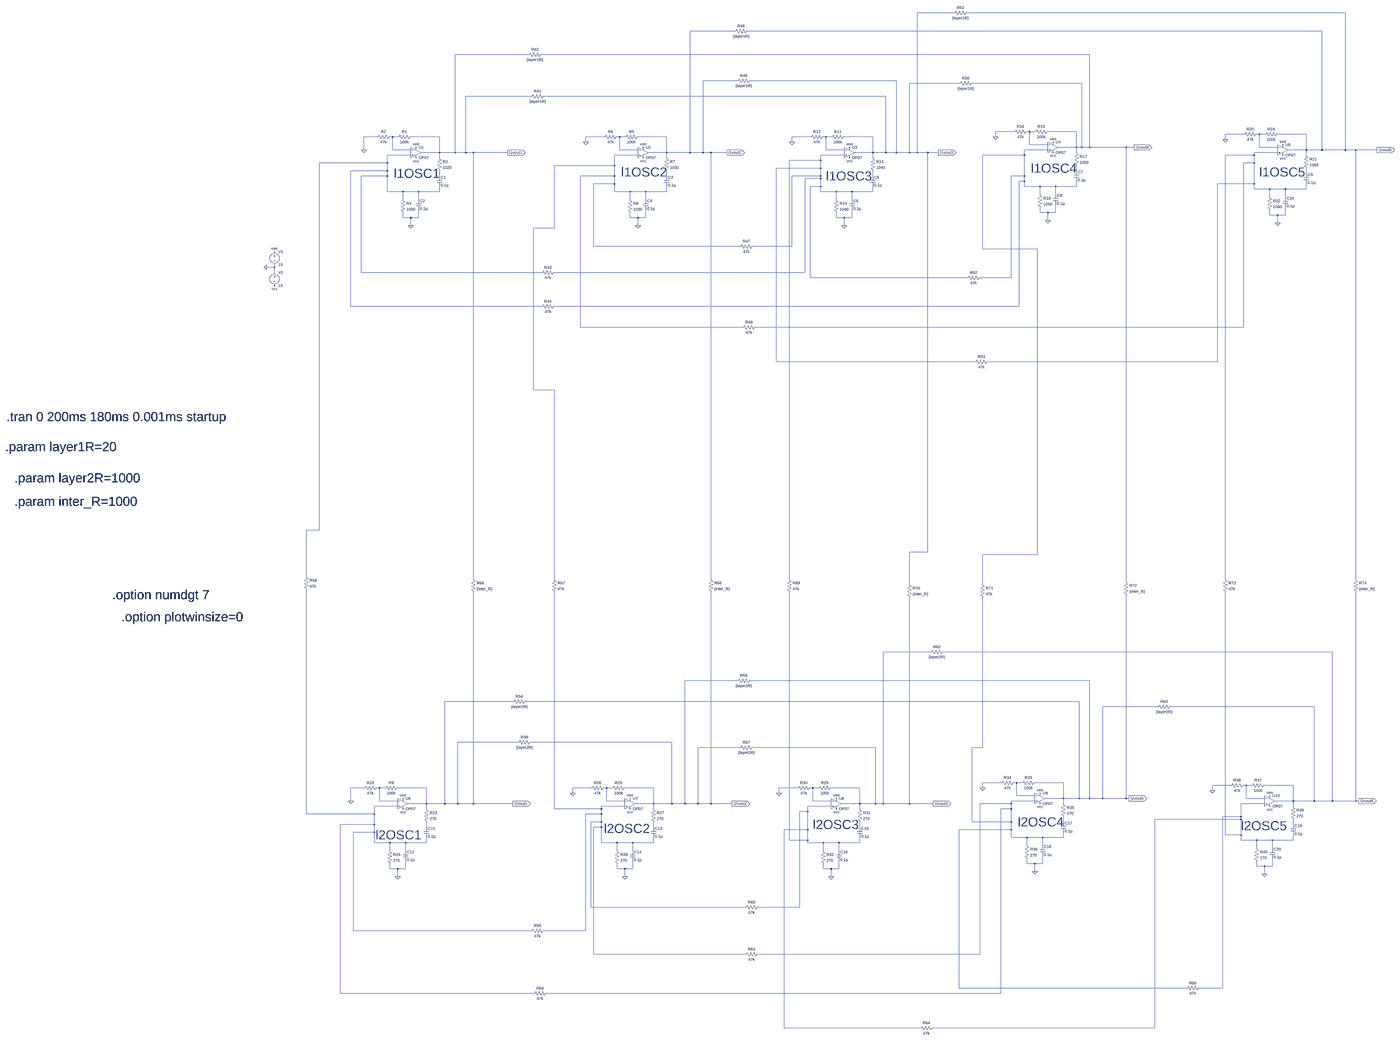
[diagram p0: schematic coupled_wein_bridge_mirror_interlayer.asc, whole sheet]
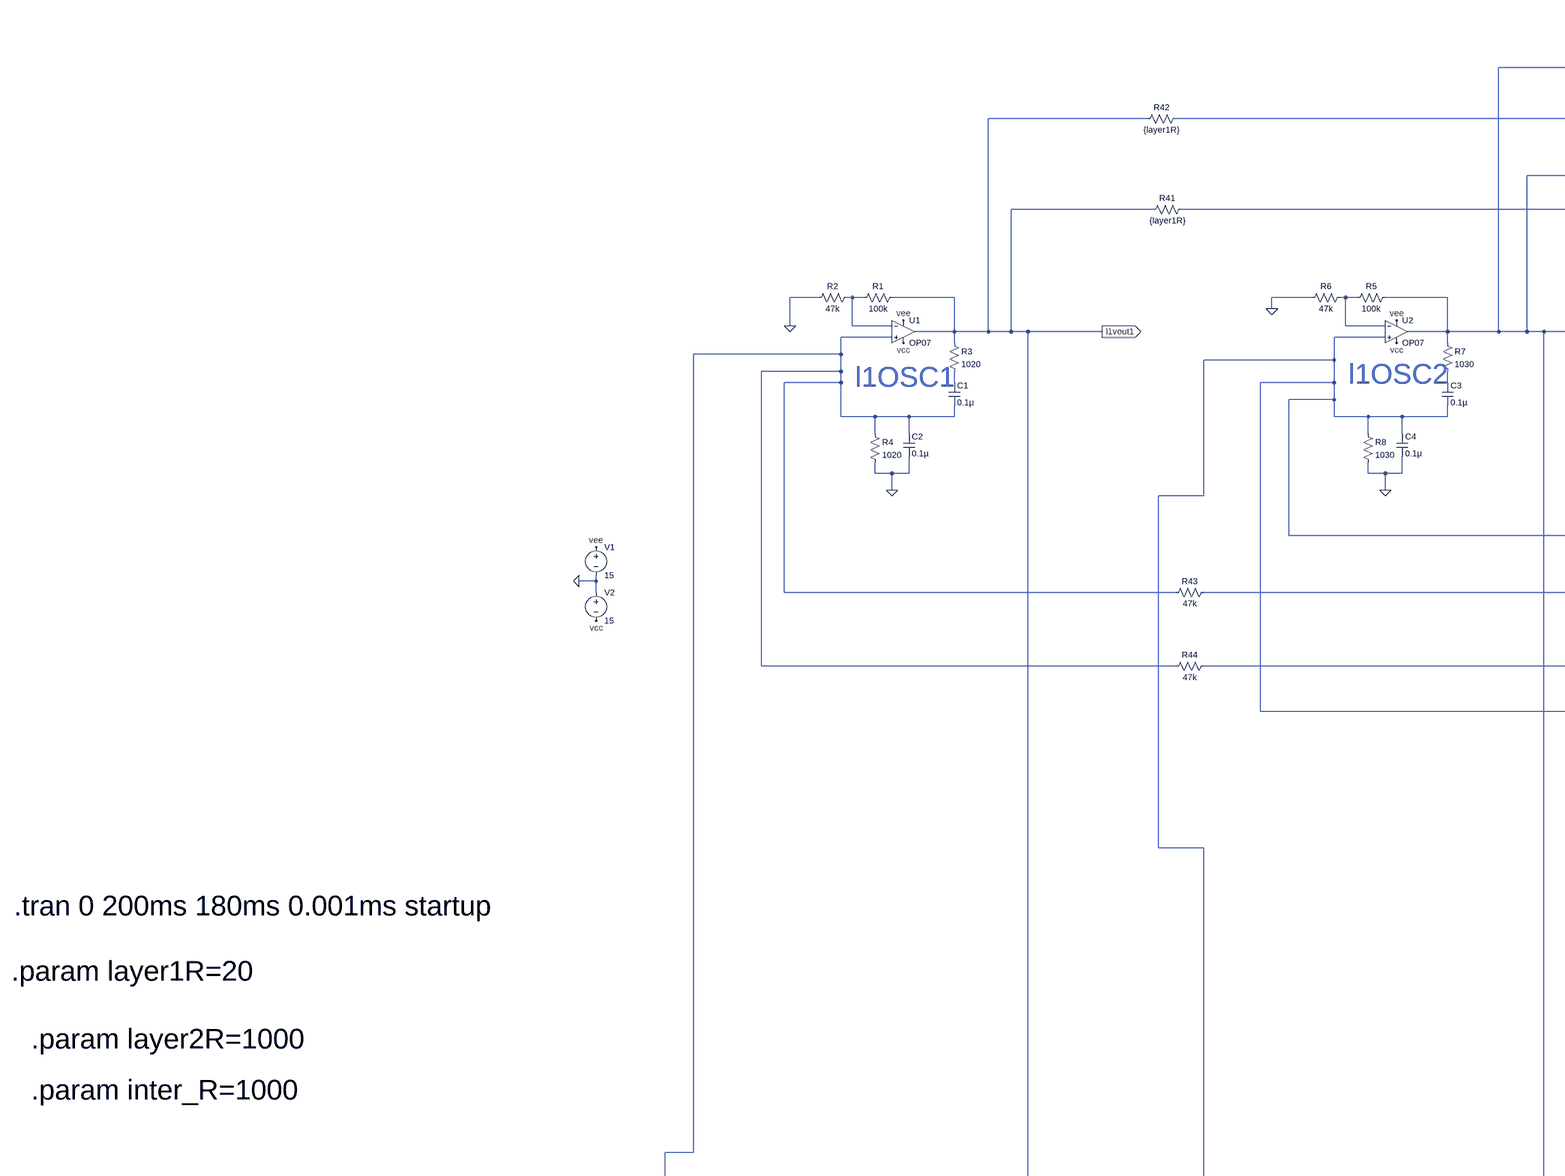
[diagram p1: schematic coupled_wein_bridge_mirror_interlayer.asc, part, row 1 of 2, column 1 of 2]
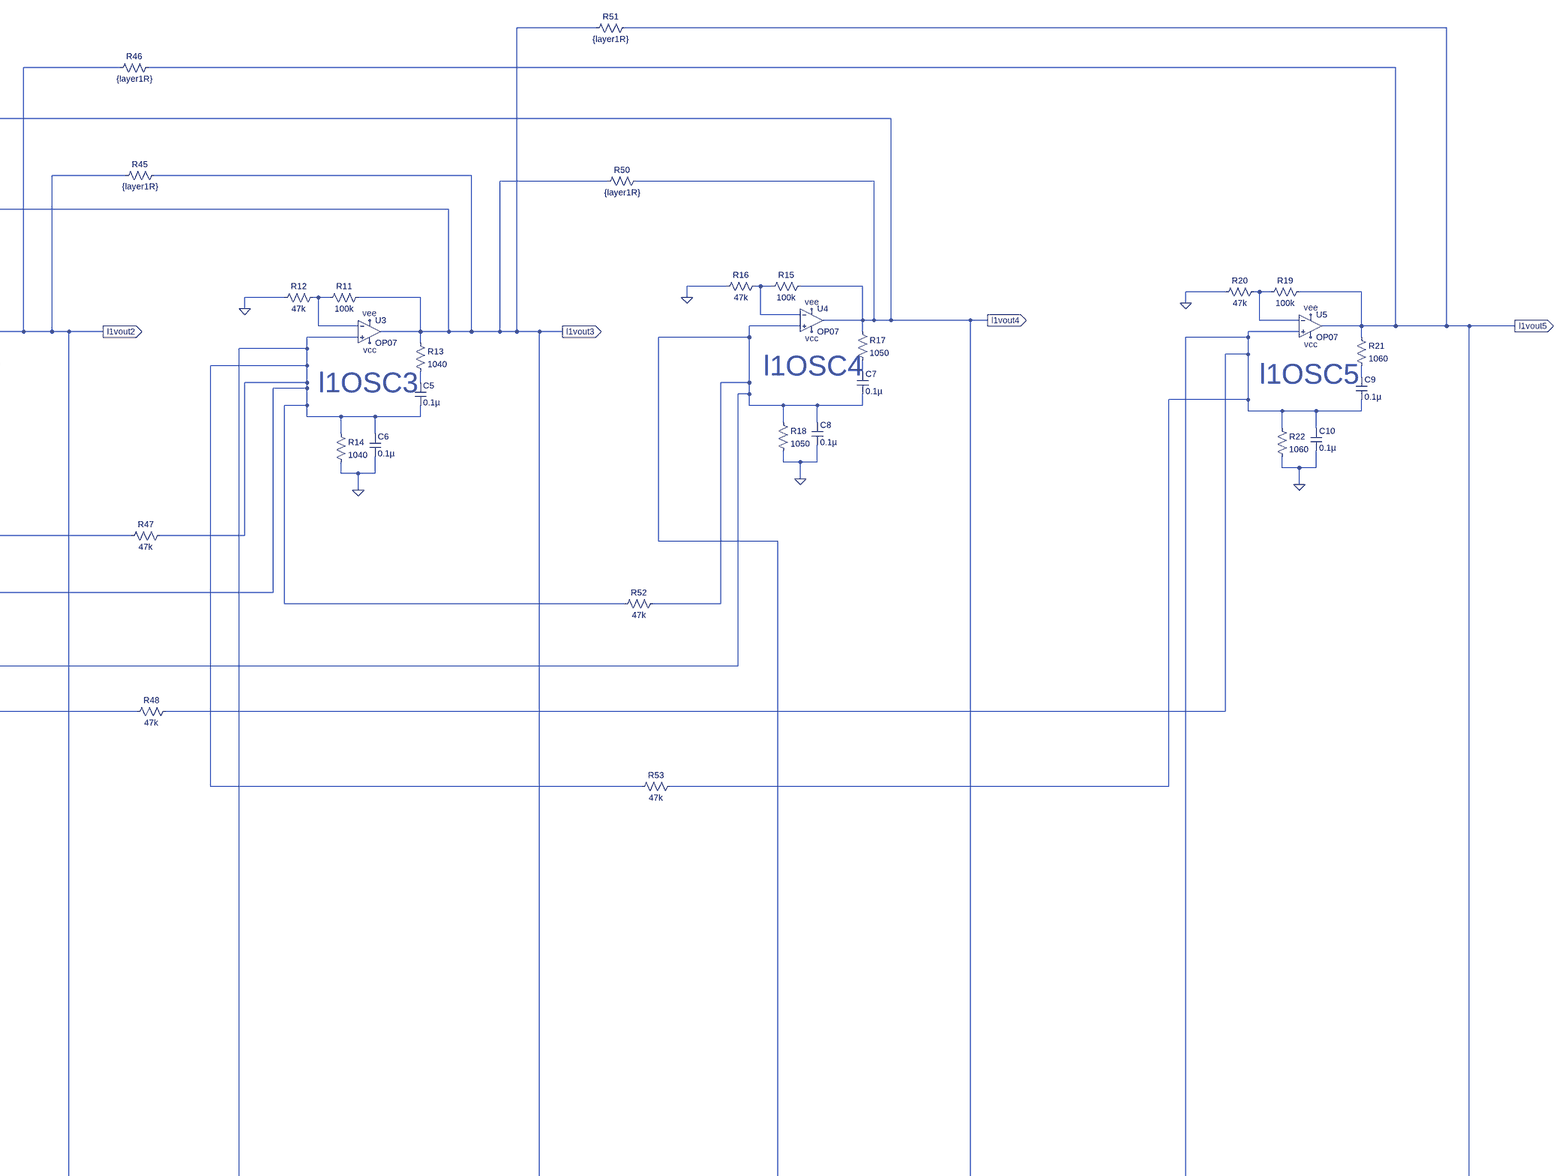
[diagram p2: schematic coupled_wein_bridge_mirror_interlayer.asc, part, row 1 of 2, column 2 of 2]
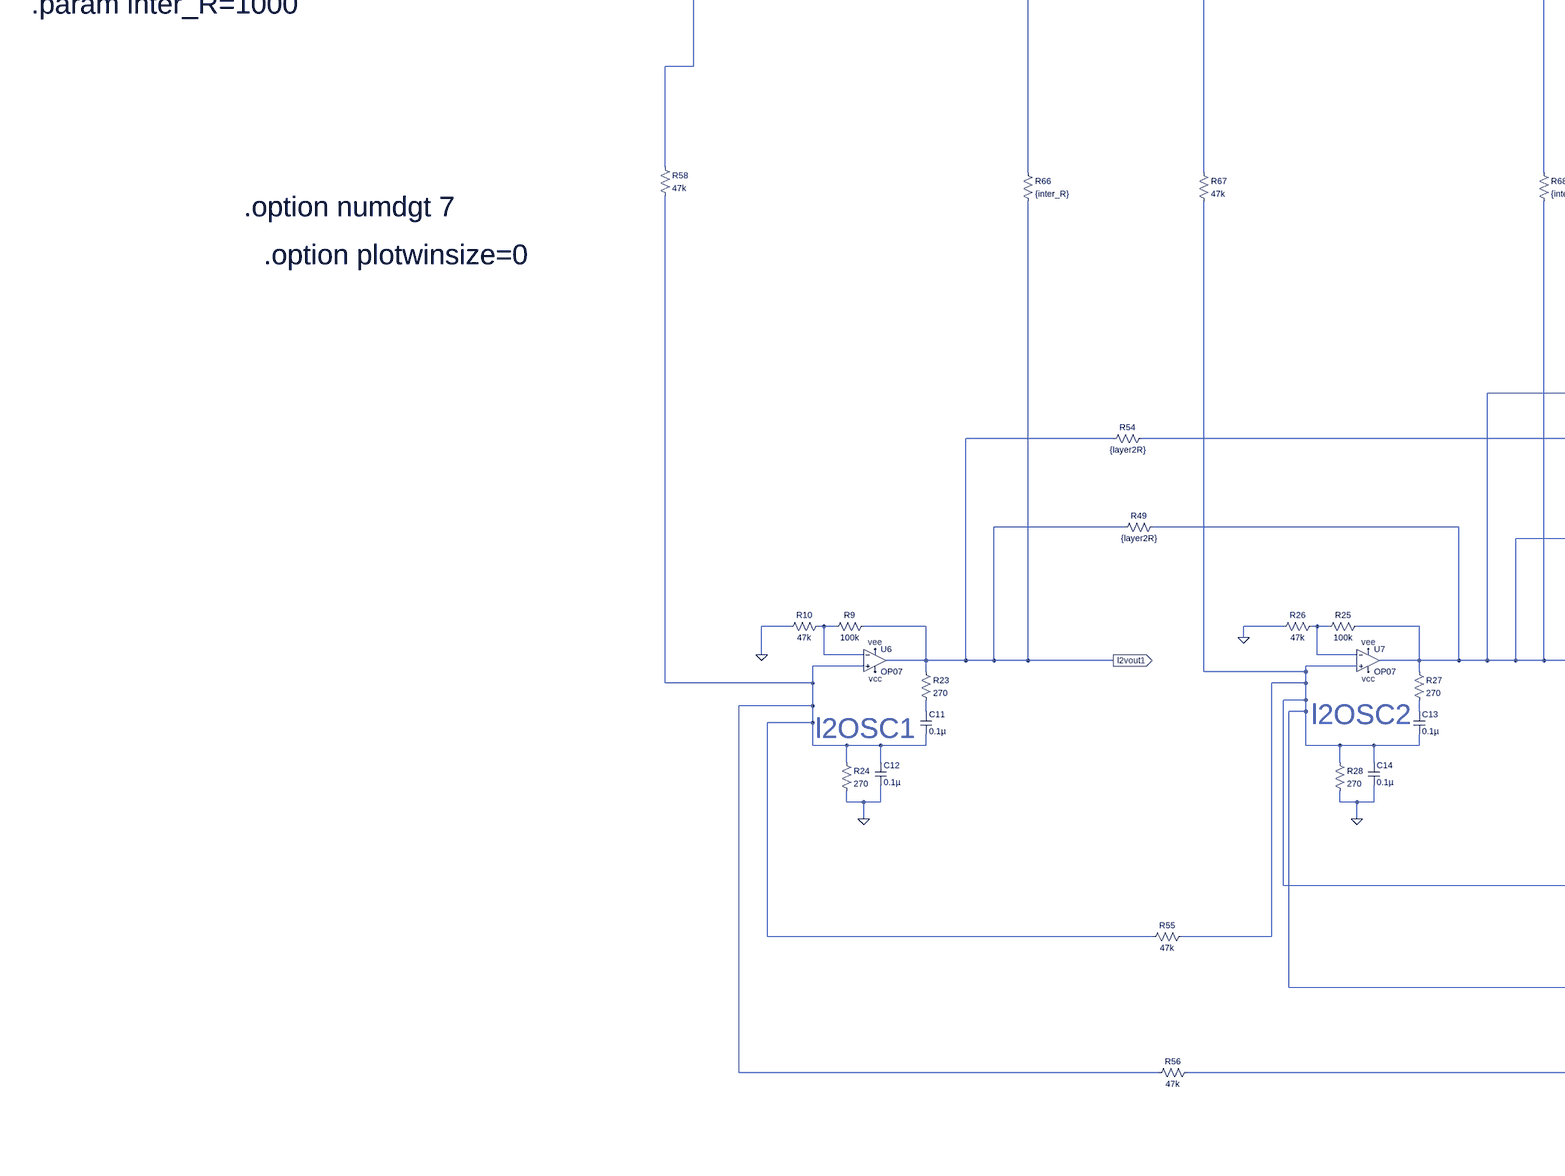
[diagram p3: schematic coupled_wein_bridge_mirror_interlayer.asc, part, row 2 of 2, column 1 of 2]
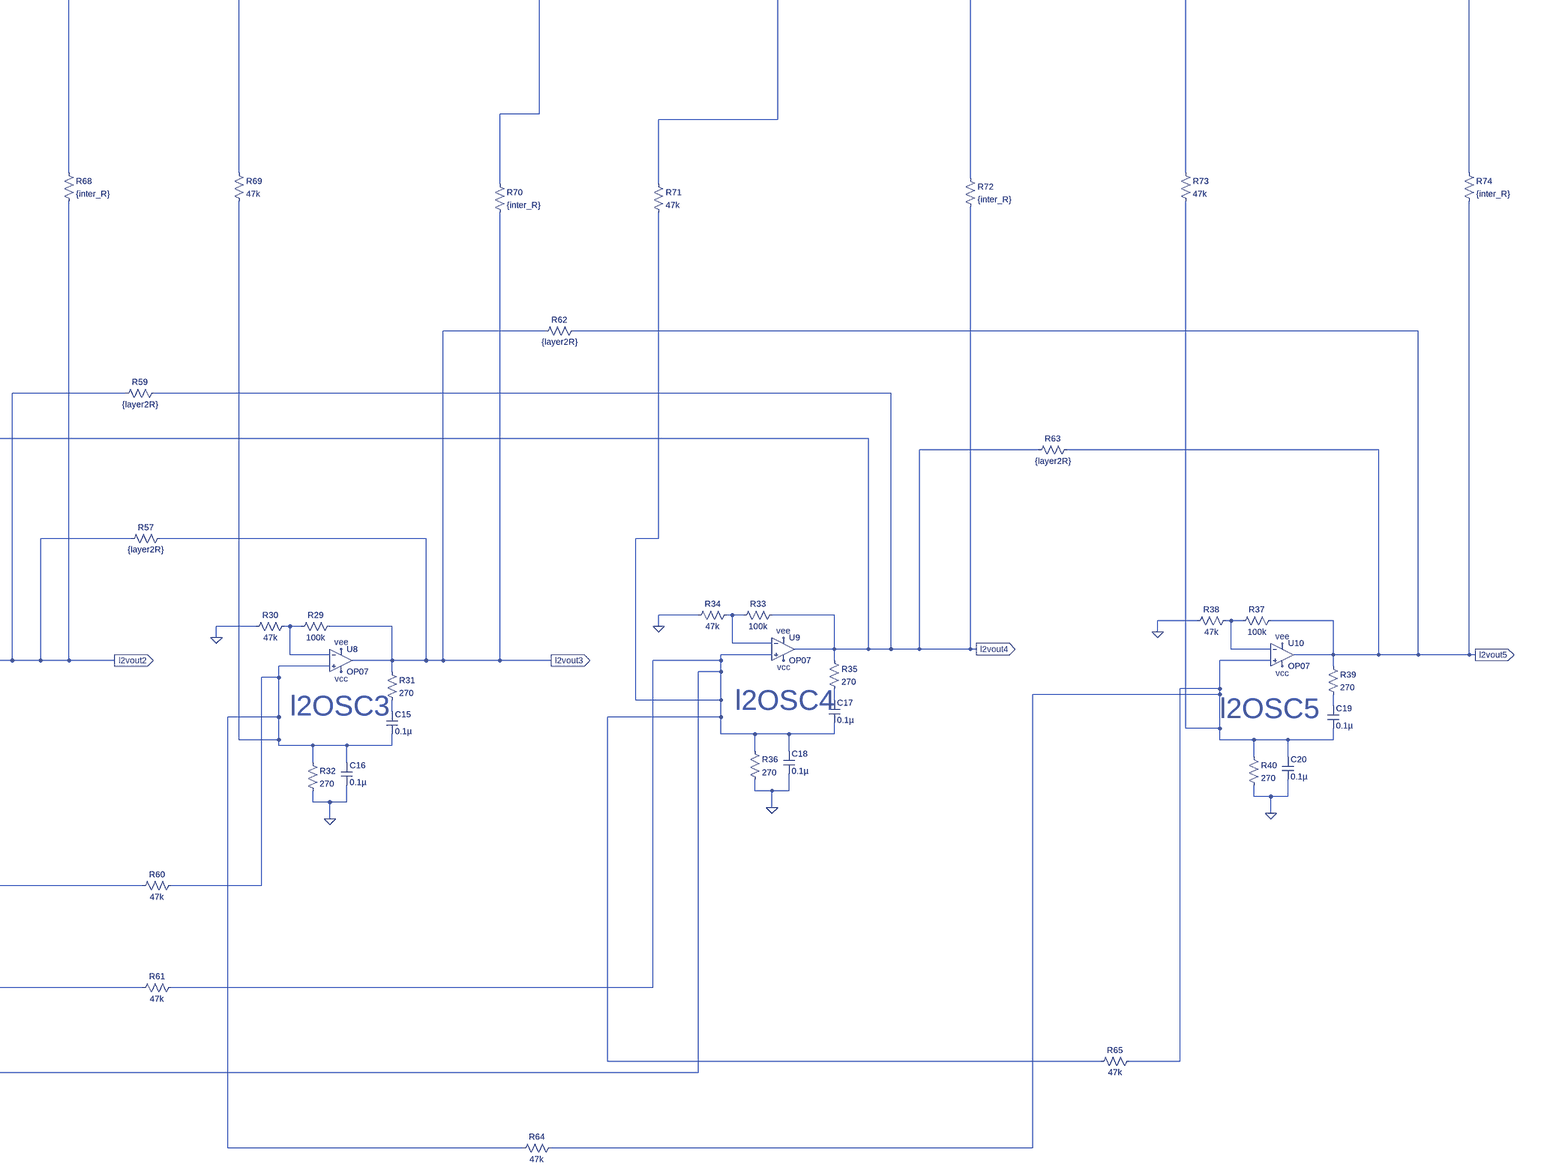
[diagram p4: schematic coupled_wein_bridge_mirror_interlayer.asc, part, row 2 of 2, column 2 of 2]
coupled_wein_bridge_mirror_interlayer.asc, the LTspice schematic file:
Version 4.1
SHEET 1 3756 7424
WIRE 112 -736 -112 -736
WIRE 2512 -736 192 -736
WIRE -1232 -624 -1504 -624
WIRE 2368 -624 -1152 -624
WIRE -2496 -480 -2944 -480
WIRE 944 -480 -2416 -480
WIRE -1216 -320 -1424 -320
WIRE -240 -320 -1136 -320
WIRE 144 -304 -160 -304
WIRE 896 -304 224 -304
WIRE -2480 -224 -2880 -224
WIRE -304 -224 -2400 -224
WIRE 480 128 368 128
WIRE 576 128 560 128
WIRE 608 128 576 128
WIRE 864 128 688 128
WIRE 1888 144 1776 144
WIRE 1984 144 1968 144
WIRE 2016 144 1984 144
WIRE 2272 144 2096 144
WIRE -3424 160 -3504 160
WIRE -3328 160 -3344 160
WIRE -3296 160 -3328 160
WIRE -3040 160 -3216 160
WIRE -2032 160 -2144 160
WIRE -1936 160 -1952 160
WIRE -1904 160 -1936 160
WIRE -1648 160 -1824 160
WIRE -768 160 -880 160
WIRE -672 160 -688 160
WIRE -640 160 -672 160
WIRE -384 160 -560 160
WIRE 368 160 368 128
WIRE 1776 176 1776 144
WIRE -2144 192 -2144 160
WIRE -880 192 -880 160
WIRE 576 208 576 128
WIRE 688 208 576 208
WIRE 864 224 864 128
WIRE 864 224 752 224
WIRE 896 224 896 -304
WIRE 896 224 864 224
WIRE 944 224 944 -480
WIRE 944 224 896 224
WIRE 1168 224 944 224
WIRE 1216 224 1168 224
WIRE 1984 224 1984 144
WIRE 2096 224 1984 224
WIRE -3504 240 -3504 160
WIRE -3328 240 -3328 160
WIRE -3216 240 -3328 240
WIRE -1936 240 -1936 160
WIRE -1824 240 -1936 240
WIRE -672 240 -672 160
WIRE -560 240 -672 240
WIRE 688 240 544 240
WIRE 2272 240 2272 144
WIRE 2272 240 2160 240
WIRE 2368 240 2368 -624
WIRE 2368 240 2272 240
WIRE 2512 240 2512 -736
WIRE 2512 240 2368 240
WIRE 2576 240 2512 240
WIRE 2704 240 2576 240
WIRE -3040 256 -3040 160
WIRE -3040 256 -3152 256
WIRE -2944 256 -2944 -480
WIRE -2944 256 -3040 256
WIRE -2880 256 -2880 -224
WIRE -2880 256 -2944 256
WIRE -2832 256 -2880 256
WIRE -2624 256 -2832 256
WIRE -1648 256 -1648 160
WIRE -1648 256 -1760 256
WIRE -1504 256 -1504 -624
WIRE -1504 256 -1648 256
WIRE -1424 256 -1424 -320
WIRE -1424 256 -1504 256
WIRE -1376 256 -1424 256
WIRE -1280 256 -1376 256
WIRE -384 256 -384 160
WIRE -384 256 -496 256
WIRE -304 256 -304 -224
WIRE -304 256 -384 256
WIRE -240 256 -240 -320
WIRE -240 256 -304 256
WIRE -160 256 -160 -304
WIRE -160 256 -240 256
WIRE -112 256 -112 -736
WIRE -112 256 -160 256
WIRE -48 256 -112 256
WIRE 16 256 -48 256
WIRE 864 256 864 224
WIRE 2096 256 1952 256
WIRE -3216 272 -3360 272
WIRE -1824 272 -1968 272
WIRE -560 272 -704 272
WIRE 544 272 544 240
WIRE 544 272 288 272
WIRE 1952 272 1952 256
WIRE 1952 272 1776 272
WIRE 2272 272 2272 240
WIRE -3040 288 -3040 256
WIRE -1648 288 -1648 256
WIRE -384 288 -384 256
WIRE -704 304 -704 272
WIRE -704 304 -896 304
WIRE -3360 320 -3360 272
WIRE -3360 320 -3776 320
WIRE 1952 320 1952 272
WIRE 1952 320 1888 320
WIRE -1968 336 -1968 272
WIRE -1968 336 -2336 336
WIRE -704 352 -704 304
WIRE -704 352 -976 352
WIRE -3360 368 -3360 320
WIRE -3360 368 -3584 368
WIRE 864 368 864 336
WIRE 2272 384 2272 352
WIRE -3360 400 -3360 368
WIRE -3360 400 -3520 400
WIRE -3040 400 -3040 368
WIRE -1968 400 -1968 336
WIRE -1968 400 -2176 400
WIRE -1648 400 -1648 368
WIRE -704 400 -704 352
WIRE -704 400 -880 400
WIRE -384 400 -384 368
WIRE 544 400 544 272
WIRE 544 400 464 400
WIRE -704 416 -704 400
WIRE -704 416 -800 416
WIRE 544 432 544 400
WIRE 544 432 512 432
WIRE -1968 448 -1968 400
WIRE -1968 448 -2096 448
WIRE 1952 448 1952 320
WIRE 1952 448 1728 448
WIRE -704 464 -704 416
WIRE -704 464 -768 464
WIRE 544 464 544 432
WIRE 640 464 544 464
WIRE 736 464 640 464
WIRE 864 464 864 432
WIRE 864 464 736 464
WIRE 1952 480 1952 448
WIRE 2048 480 1952 480
WIRE 2144 480 2048 480
WIRE 2272 480 2272 448
WIRE 2272 480 2144 480
WIRE -3360 496 -3360 400
WIRE -3264 496 -3360 496
WIRE -3168 496 -3264 496
WIRE -3040 496 -3040 464
WIRE -3040 496 -3168 496
WIRE -1968 496 -1968 448
WIRE -1872 496 -1968 496
WIRE -1776 496 -1872 496
WIRE -1648 496 -1648 464
WIRE -1648 496 -1776 496
WIRE -704 496 -704 464
WIRE -608 496 -704 496
WIRE -512 496 -608 496
WIRE -384 496 -384 464
WIRE -384 496 -512 496
WIRE 640 512 640 464
WIRE 736 512 736 464
WIRE 2048 528 2048 480
WIRE 2144 528 2144 480
WIRE -3264 544 -3264 496
WIRE -3168 544 -3168 496
WIRE -1872 544 -1872 496
WIRE -1776 544 -1776 496
WIRE -608 544 -608 496
WIRE -512 544 -512 496
WIRE 640 624 640 592
WIRE 688 624 640 624
WIRE 736 624 736 576
WIRE 736 624 688 624
WIRE 2048 640 2048 608
WIRE 2096 640 2048 640
WIRE 2144 640 2144 592
WIRE 2144 640 2096 640
WIRE -3264 656 -3264 624
WIRE -3216 656 -3264 656
WIRE -3168 656 -3168 608
WIRE -3168 656 -3216 656
WIRE -1872 656 -1872 624
WIRE -1824 656 -1872 656
WIRE -1776 656 -1776 608
WIRE -1776 656 -1824 656
WIRE -608 656 -608 624
WIRE -560 656 -608 656
WIRE -512 656 -512 608
WIRE -512 656 -560 656
WIRE 688 672 688 624
WIRE 2096 688 2096 640
WIRE -3216 704 -3216 656
WIRE -1824 704 -1824 656
WIRE -560 704 -560 656
WIRE -2336 720 -2336 336
WIRE -2336 720 -2464 720
WIRE -2096 832 -2096 448
WIRE -1200 832 -2096 832
WIRE -880 832 -880 400
WIRE -880 832 -1120 832
WIRE 288 848 288 272
WIRE 624 848 288 848
WIRE -4064 960 -4064 944
WIRE -4064 960 -4112 960
WIRE -4064 992 -4064 960
WIRE -3520 992 -3520 400
WIRE -2416 992 -3520 992
WIRE -800 992 -800 416
WIRE -800 992 -2336 992
WIRE -768 1024 -768 464
WIRE 192 1024 -768 1024
WIRE 464 1024 464 400
WIRE 464 1024 272 1024
WIRE -3584 1200 -3584 368
WIRE -2416 1200 -3584 1200
WIRE 512 1200 512 432
WIRE 512 1200 -2336 1200
WIRE -2176 1328 -2176 400
WIRE -1184 1328 -2176 1328
WIRE 1888 1328 1888 320
WIRE 1888 1328 -1104 1328
WIRE -976 1552 -976 352
WIRE 240 1552 -976 1552
WIRE 1728 1552 1728 448
WIRE 1728 1552 320 1552
WIRE -2464 1728 -2464 720
WIRE -2336 1728 -2464 1728
WIRE -3776 2720 -3776 320
WIRE -3776 2720 -3856 2720
WIRE -48 2880 -48 256
WIRE -48 2880 -160 2880
WIRE 624 2896 624 848
WIRE 624 2896 288 2896
WIRE -3856 3152 -3856 2720
WIRE -2832 3168 -2832 256
WIRE -2336 3168 -2336 1728
WIRE -1376 3168 -1376 256
WIRE -896 3168 -896 304
WIRE 1776 3168 1776 272
WIRE 2576 3168 2576 240
WIRE 1168 3184 1168 224
WIRE -160 3200 -160 2880
WIRE 288 3200 288 2896
WIRE -32 3744 -320 3744
WIRE 2432 3744 48 3744
WIRE -1216 3920 -1536 3920
WIRE 944 3920 -1136 3920
WIRE -2592 4048 -3008 4048
WIRE 880 4048 -2512 4048
WIRE 1360 4080 1024 4080
WIRE 2320 4080 1440 4080
WIRE -2560 4368 -2928 4368
WIRE -1616 4368 -2480 4368
WIRE -1200 4400 -1456 4400
WIRE -368 4400 -1120 4400
WIRE 288 4400 288 3280
WIRE 288 4400 224 4400
WIRE 400 4832 288 4832
WIRE 496 4832 480 4832
WIRE 528 4832 496 4832
WIRE 784 4832 608 4832
WIRE 1808 4848 1696 4848
WIRE 1904 4848 1888 4848
WIRE 1936 4848 1904 4848
WIRE 2192 4848 2016 4848
WIRE -3504 4864 -3584 4864
WIRE -3408 4864 -3424 4864
WIRE -3376 4864 -3408 4864
WIRE -3120 4864 -3296 4864
WIRE -2112 4864 -2224 4864
WIRE -2016 4864 -2032 4864
WIRE -1984 4864 -2016 4864
WIRE -1728 4864 -1904 4864
WIRE -848 4864 -960 4864
WIRE -752 4864 -768 4864
WIRE -720 4864 -752 4864
WIRE -464 4864 -640 4864
WIRE 288 4864 288 4832
WIRE 1696 4880 1696 4848
WIRE -2224 4896 -2224 4864
WIRE -960 4896 -960 4864
WIRE 496 4912 496 4832
WIRE 608 4912 496 4912
WIRE 784 4928 784 4832
WIRE 784 4928 672 4928
WIRE 880 4928 880 4048
WIRE 880 4928 784 4928
WIRE 944 4928 944 3920
WIRE 944 4928 880 4928
WIRE 1024 4928 1024 4080
WIRE 1024 4928 944 4928
WIRE 1168 4928 1168 3264
WIRE 1168 4928 1024 4928
WIRE 1184 4928 1168 4928
WIRE 1904 4928 1904 4848
WIRE 2016 4928 1904 4928
WIRE -3584 4944 -3584 4864
WIRE -3408 4944 -3408 4864
WIRE -3296 4944 -3408 4944
WIRE -2016 4944 -2016 4864
WIRE -1904 4944 -2016 4944
WIRE -752 4944 -752 4864
WIRE -640 4944 -752 4944
WIRE 608 4944 464 4944
WIRE 2192 4944 2192 4848
WIRE 2192 4944 2080 4944
WIRE 2320 4944 2320 4080
WIRE 2320 4944 2192 4944
WIRE 2432 4944 2432 3744
WIRE 2432 4944 2320 4944
WIRE 2576 4944 2576 3248
WIRE 2576 4944 2432 4944
WIRE 2592 4944 2576 4944
WIRE -3120 4960 -3120 4864
WIRE -3120 4960 -3232 4960
WIRE -3008 4960 -3008 4048
WIRE -3008 4960 -3120 4960
WIRE -2928 4960 -2928 4368
WIRE -2928 4960 -3008 4960
WIRE -2832 4960 -2832 3248
WIRE -2832 4960 -2928 4960
WIRE -2592 4960 -2832 4960
WIRE -1728 4960 -1728 4864
WIRE -1728 4960 -1840 4960
WIRE -1616 4960 -1616 4368
WIRE -1616 4960 -1728 4960
WIRE -1536 4960 -1536 3920
WIRE -1536 4960 -1616 4960
WIRE -1456 4960 -1456 4400
WIRE -1456 4960 -1536 4960
WIRE -1376 4960 -1376 3248
WIRE -1376 4960 -1456 4960
WIRE -1248 4960 -1376 4960
WIRE -464 4960 -464 4864
WIRE -464 4960 -576 4960
WIRE -368 4960 -368 4400
WIRE -368 4960 -464 4960
WIRE -320 4960 -320 3744
WIRE -320 4960 -368 4960
WIRE -160 4960 -160 3280
WIRE -160 4960 -320 4960
WIRE -16 4960 -160 4960
WIRE 464 4960 464 4944
WIRE 464 4960 272 4960
WIRE 784 4960 784 4928
WIRE 2016 4960 1872 4960
WIRE -3296 4976 -3440 4976
WIRE -1904 4976 -2048 4976
WIRE -640 4976 -784 4976
WIRE 2192 4976 2192 4944
WIRE -3120 4992 -3120 4960
WIRE -2336 4992 -2336 3248
WIRE -2048 4992 -2048 4976
WIRE -2048 4992 -2336 4992
WIRE -1728 4992 -1728 4960
WIRE -464 4992 -464 4960
WIRE 464 4992 464 4960
WIRE 464 4992 400 4992
WIRE -784 5008 -784 4976
WIRE -784 5008 -832 5008
WIRE -3856 5024 -3856 3232
WIRE -3440 5024 -3440 4976
WIRE -3440 5024 -3856 5024
WIRE -2048 5024 -2048 4992
WIRE -2048 5024 -2144 5024
WIRE 1872 5040 1872 4960
WIRE 1872 5040 1760 5040
WIRE 1872 5056 1872 5040
WIRE 1872 5056 1344 5056
WIRE -2048 5072 -2048 5024
WIRE -2048 5072 -2112 5072
WIRE 224 5072 224 4400
WIRE 464 5072 464 4992
WIRE 464 5072 224 5072
WIRE 784 5072 784 5040
WIRE -3440 5088 -3440 5024
WIRE -3440 5088 -3648 5088
WIRE 2192 5088 2192 5056
WIRE -3120 5104 -3120 5072
WIRE -2048 5104 -2048 5072
WIRE -2048 5104 -2096 5104
WIRE -1728 5104 -1728 5072
WIRE -464 5104 -464 5072
WIRE -784 5120 -784 5008
WIRE -784 5120 -928 5120
WIRE 464 5120 464 5072
WIRE 464 5120 144 5120
WIRE -3440 5136 -3440 5088
WIRE -3440 5136 -3568 5136
WIRE 1776 5152 1776 3248
WIRE 1872 5152 1872 5056
WIRE 1872 5152 1776 5152
WIRE 464 5168 464 5120
WIRE 560 5168 464 5168
WIRE 656 5168 560 5168
WIRE 784 5168 784 5136
WIRE 784 5168 656 5168
WIRE -896 5184 -896 3248
WIRE -784 5184 -784 5120
WIRE -784 5184 -896 5184
WIRE 1872 5184 1872 5152
WIRE 1968 5184 1872 5184
WIRE 2064 5184 1968 5184
WIRE 2192 5184 2192 5152
WIRE 2192 5184 2064 5184
WIRE -3440 5200 -3440 5136
WIRE -3344 5200 -3440 5200
WIRE -3248 5200 -3344 5200
WIRE -3120 5200 -3120 5168
WIRE -3120 5200 -3248 5200
WIRE -2048 5200 -2048 5104
WIRE -1952 5200 -2048 5200
WIRE -1856 5200 -1952 5200
WIRE -1728 5200 -1728 5168
WIRE -1728 5200 -1856 5200
WIRE -784 5200 -784 5184
WIRE -688 5200 -784 5200
WIRE -592 5200 -688 5200
WIRE -464 5200 -464 5168
WIRE -464 5200 -592 5200
WIRE 560 5216 560 5168
WIRE 656 5216 656 5168
WIRE 1968 5232 1968 5184
WIRE 2064 5232 2064 5184
WIRE -3344 5248 -3344 5200
WIRE -3248 5248 -3248 5200
WIRE -1952 5248 -1952 5200
WIRE -1856 5248 -1856 5200
WIRE -688 5248 -688 5200
WIRE -592 5248 -592 5200
WIRE 560 5328 560 5296
WIRE 608 5328 560 5328
WIRE 656 5328 656 5280
WIRE 656 5328 608 5328
WIRE 1968 5344 1968 5312
WIRE 2016 5344 1968 5344
WIRE 2064 5344 2064 5296
WIRE 2064 5344 2016 5344
WIRE -3344 5360 -3344 5328
WIRE -3296 5360 -3344 5360
WIRE -3248 5360 -3248 5312
WIRE -3248 5360 -3296 5360
WIRE -1952 5360 -1952 5328
WIRE -1904 5360 -1952 5360
WIRE -1856 5360 -1856 5312
WIRE -1856 5360 -1904 5360
WIRE -688 5360 -688 5328
WIRE -640 5360 -688 5360
WIRE -592 5360 -592 5312
WIRE -592 5360 -640 5360
WIRE 608 5376 608 5328
WIRE 2016 5392 2016 5344
WIRE -3296 5408 -3296 5360
WIRE -1904 5408 -1904 5360
WIRE -640 5408 -640 5360
WIRE -2112 5600 -2112 5072
WIRE -1168 5600 -2112 5600
WIRE -832 5600 -832 5008
WIRE -832 5600 -1088 5600
WIRE -3568 5744 -3568 5136
WIRE -2480 5744 -3568 5744
WIRE -2144 5744 -2144 5024
WIRE -2144 5744 -2400 5744
WIRE -2096 5888 -2096 5104
WIRE -1168 5888 -2096 5888
WIRE 272 5888 272 4960
WIRE 272 5888 -1088 5888
WIRE 144 6096 144 5120
WIRE 1536 6096 144 6096
WIRE 1760 6096 1760 5040
WIRE 1760 6096 1616 6096
WIRE -3648 6128 -3648 5088
WIRE -2464 6128 -3648 6128
WIRE 400 6128 400 4992
WIRE 400 6128 -2384 6128
WIRE -928 6400 -928 5120
WIRE -96 6400 -928 6400
WIRE 1344 6400 1344 5056
WIRE 1344 6400 -16 6400
FLAG -4112 960 0
FLAG -4064 864 vee
FLAG -4064 1072 vcc
FLAG -3184 224 vee
FLAG -3184 288 vcc
FLAG -3216 704 0
FLAG -2624 256 l1vout1
IOPIN -2624 256 Out
FLAG -1792 224 vee
FLAG -1792 288 vcc
FLAG -1824 704 0
FLAG -1280 256 l1vout2
IOPIN -1280 256 Out
FLAG -3504 240 0
FLAG -2144 192 0
FLAG -528 224 vee
FLAG -528 288 vcc
FLAG -560 704 0
FLAG 16 256 l1vout3
IOPIN 16 256 Out
FLAG -880 192 0
FLAG 720 192 vee
FLAG 720 256 vcc
FLAG 688 672 0
FLAG 1216 224 l1vout4
IOPIN 1216 224 Out
FLAG 368 160 0
FLAG 2128 208 vee
FLAG 2128 272 vcc
FLAG 2096 688 0
FLAG 2704 240 l1vout5
IOPIN 2704 240 Out
FLAG 1776 176 0
FLAG -3264 4928 vee
FLAG -3264 4992 vcc
FLAG -3296 5408 0
FLAG -2592 4960 l2vout1
IOPIN -2592 4960 Out
FLAG -1872 4928 vee
FLAG -1872 4992 vcc
FLAG -1904 5408 0
FLAG -1248 4960 l2vout2
IOPIN -1248 4960 Out
FLAG -3584 4944 0
FLAG -2224 4896 0
FLAG -608 4928 vee
FLAG -608 4992 vcc
FLAG -640 5408 0
FLAG -16 4960 l2vout3
IOPIN -16 4960 Out
FLAG -960 4896 0
FLAG 640 4896 vee
FLAG 640 4960 vcc
FLAG 608 5376 0
FLAG 1184 4928 l2vout4
IOPIN 1184 4928 Out
FLAG 288 4864 0
FLAG 2048 4912 vee
FLAG 2048 4976 vcc
FLAG 2016 5392 0
FLAG 2592 4944 l2vout5
IOPIN 2592 4944 Out
FLAG 1696 4880 0
SYMBOL voltage -4064 848 R0
SYMATTR InstName V1
SYMATTR Value 15
SYMBOL voltage -4064 976 R0
SYMATTR InstName V2
SYMATTR Value 15
SYMBOL OpAmps\\OP07 -3184 192 R0
SYMATTR InstName U1
SYMBOL res -3200 144 R90
WINDOW 0 0 56 VBottom 2
WINDOW 3 32 56 VTop 2
SYMATTR InstName R1
SYMATTR Value 100k
SYMBOL res -3328 144 R90
WINDOW 0 0 56 VBottom 2
WINDOW 3 32 56 VTop 2
SYMATTR InstName R2
SYMATTR Value 47k
SYMBOL res -3056 272 R0
SYMATTR InstName R3
SYMATTR Value 1020
SYMBOL cap -3056 400 R0
SYMATTR InstName C1
SYMATTR Value 0.1µ
SYMBOL res -3280 528 R0
SYMATTR InstName R4
SYMATTR Value 1020
SYMBOL cap -3184 544 R0
SYMATTR InstName C2
SYMATTR Value 0.1µ
SYMBOL OpAmps\\OP07 -1792 192 R0
SYMATTR InstName U2
SYMBOL res -1808 144 R90
WINDOW 0 0 56 VBottom 2
WINDOW 3 32 56 VTop 2
SYMATTR InstName R5
SYMATTR Value 100k
SYMBOL res -1936 144 R90
WINDOW 0 0 56 VBottom 2
WINDOW 3 32 56 VTop 2
SYMATTR InstName R6
SYMATTR Value 47k
SYMBOL res -1664 272 R0
SYMATTR InstName R7
SYMATTR Value 1030
SYMBOL cap -1664 400 R0
SYMATTR InstName C3
SYMATTR Value 0.1µ
SYMBOL res -1888 528 R0
SYMATTR InstName R8
SYMATTR Value 1030
SYMBOL cap -1792 544 R0
SYMATTR InstName C4
SYMATTR Value 0.1µ
SYMBOL OpAmps\\OP07 -528 192 R0
SYMATTR InstName U3
SYMBOL res -544 144 R90
WINDOW 0 0 56 VBottom 2
WINDOW 3 32 56 VTop 2
SYMATTR InstName R11
SYMATTR Value 100k
SYMBOL res -672 144 R90
WINDOW 0 0 56 VBottom 2
WINDOW 3 32 56 VTop 2
SYMATTR InstName R12
SYMATTR Value 47k
SYMBOL res -400 272 R0
SYMATTR InstName R13
SYMATTR Value 1040
SYMBOL cap -400 400 R0
SYMATTR InstName C5
SYMATTR Value 0.1µ
SYMBOL res -624 528 R0
SYMATTR InstName R14
SYMATTR Value 1040
SYMBOL cap -528 544 R0
SYMATTR InstName C6
SYMATTR Value 0.1µ
SYMBOL OpAmps\\OP07 720 160 R0
SYMATTR InstName U4
SYMBOL res 704 112 R90
WINDOW 0 0 56 VBottom 2
WINDOW 3 32 56 VTop 2
SYMATTR InstName R15
SYMATTR Value 100k
SYMBOL res 576 112 R90
WINDOW 0 0 56 VBottom 2
WINDOW 3 32 56 VTop 2
SYMATTR InstName R16
SYMATTR Value 47k
SYMBOL res 848 240 R0
SYMATTR InstName R17
SYMATTR Value 1050
SYMBOL cap 848 368 R0
SYMATTR InstName C7
SYMATTR Value 0.1µ
SYMBOL res 624 496 R0
SYMATTR InstName R18
SYMATTR Value 1050
SYMBOL cap 720 512 R0
SYMATTR InstName C8
SYMATTR Value 0.1µ
SYMBOL OpAmps\\OP07 2128 176 R0
SYMATTR InstName U5
SYMBOL res 2112 128 R90
WINDOW 0 0 56 VBottom 2
WINDOW 3 32 56 VTop 2
SYMATTR InstName R19
SYMATTR Value 100k
SYMBOL res 1984 128 R90
WINDOW 0 0 56 VBottom 2
WINDOW 3 32 56 VTop 2
SYMATTR InstName R20
SYMATTR Value 47k
SYMBOL res 2256 256 R0
SYMATTR InstName R21
SYMATTR Value 1060
SYMBOL cap 2256 384 R0
SYMATTR InstName C9
SYMATTR Value 0.1µ
SYMBOL res 2032 512 R0
SYMATTR InstName R22
SYMATTR Value 1060
SYMBOL cap 2128 528 R0
SYMATTR InstName C10
SYMATTR Value 0.1µ
SYMBOL OpAmps\\OP07 -3264 4896 R0
SYMATTR InstName U6
SYMBOL res -3280 4848 R90
WINDOW 0 0 56 VBottom 2
WINDOW 3 32 56 VTop 2
SYMATTR InstName R9
SYMATTR Value 100k
SYMBOL res -3408 4848 R90
WINDOW 0 0 56 VBottom 2
WINDOW 3 32 56 VTop 2
SYMATTR InstName R10
SYMATTR Value 47k
SYMBOL res -3136 4976 R0
SYMATTR InstName R23
SYMATTR Value 270
SYMBOL cap -3136 5104 R0
SYMATTR InstName C11
SYMATTR Value 0.1µ
SYMBOL res -3360 5232 R0
SYMATTR InstName R24
SYMATTR Value 270
SYMBOL cap -3264 5248 R0
SYMATTR InstName C12
SYMATTR Value 0.1µ
SYMBOL OpAmps\\OP07 -1872 4896 R0
SYMATTR InstName U7
SYMBOL res -1888 4848 R90
WINDOW 0 0 56 VBottom 2
WINDOW 3 32 56 VTop 2
SYMATTR InstName R25
SYMATTR Value 100k
SYMBOL res -2016 4848 R90
WINDOW 0 0 56 VBottom 2
WINDOW 3 32 56 VTop 2
SYMATTR InstName R26
SYMATTR Value 47k
SYMBOL res -1744 4976 R0
SYMATTR InstName R27
SYMATTR Value 270
SYMBOL cap -1744 5104 R0
SYMATTR InstName C13
SYMATTR Value 0.1µ
SYMBOL res -1968 5232 R0
SYMATTR InstName R28
SYMATTR Value 270
SYMBOL cap -1872 5248 R0
SYMATTR InstName C14
SYMATTR Value 0.1µ
SYMBOL OpAmps\\OP07 -608 4896 R0
SYMATTR InstName U8
SYMBOL res -624 4848 R90
WINDOW 0 0 56 VBottom 2
WINDOW 3 32 56 VTop 2
SYMATTR InstName R29
SYMATTR Value 100k
SYMBOL res -752 4848 R90
WINDOW 0 0 56 VBottom 2
WINDOW 3 32 56 VTop 2
SYMATTR InstName R30
SYMATTR Value 47k
SYMBOL res -480 4976 R0
SYMATTR InstName R31
SYMATTR Value 270
SYMBOL cap -480 5104 R0
SYMATTR InstName C15
SYMATTR Value 0.1µ
SYMBOL res -704 5232 R0
SYMATTR InstName R32
SYMATTR Value 270
SYMBOL cap -608 5248 R0
SYMATTR InstName C16
SYMATTR Value 0.1µ
SYMBOL OpAmps\\OP07 640 4864 R0
SYMATTR InstName U9
SYMBOL res 624 4816 R90
WINDOW 0 0 56 VBottom 2
WINDOW 3 32 56 VTop 2
SYMATTR InstName R33
SYMATTR Value 100k
SYMBOL res 496 4816 R90
WINDOW 0 0 56 VBottom 2
WINDOW 3 32 56 VTop 2
SYMATTR InstName R34
SYMATTR Value 47k
SYMBOL res 768 4944 R0
SYMATTR InstName R35
SYMATTR Value 270
SYMBOL cap 768 5072 R0
SYMATTR InstName C17
SYMATTR Value 0.1µ
SYMBOL res 544 5200 R0
SYMATTR InstName R36
SYMATTR Value 270
SYMBOL cap 640 5216 R0
SYMATTR InstName C18
SYMATTR Value 0.1µ
SYMBOL OpAmps\\OP07 2048 4880 R0
SYMATTR InstName U10
SYMBOL res 2032 4832 R90
WINDOW 0 0 56 VBottom 2
WINDOW 3 32 56 VTop 2
SYMATTR InstName R37
SYMATTR Value 100k
SYMBOL res 1904 4832 R90
WINDOW 0 0 56 VBottom 2
WINDOW 3 32 56 VTop 2
SYMATTR InstName R38
SYMATTR Value 47k
SYMBOL res 2176 4960 R0
SYMATTR InstName R39
SYMATTR Value 270
SYMBOL cap 2176 5088 R0
SYMATTR InstName C19
SYMATTR Value 0.1µ
SYMBOL res 1952 5216 R0
SYMATTR InstName R40
SYMATTR Value 270
SYMBOL cap 2048 5232 R0
SYMATTR InstName C20
SYMATTR Value 0.1µ
SYMBOL res -2384 -240 R90
WINDOW 0 0 56 VBottom 2
WINDOW 3 32 56 VTop 2
SYMATTR InstName R41
SYMATTR Value {layer1R}
SYMBOL res -2400 -496 R90
WINDOW 0 0 56 VBottom 2
WINDOW 3 32 56 VTop 2
SYMATTR InstName R42
SYMATTR Value {layer1R}
SYMBOL res -2320 976 R90
WINDOW 0 0 56 VBottom 2
WINDOW 3 32 56 VTop 2
SYMATTR InstName R43
SYMATTR Value 47k
SYMBOL res -2320 1184 R90
WINDOW 0 0 56 VBottom 2
WINDOW 3 32 56 VTop 2
SYMATTR InstName R44
SYMATTR Value 47k
SYMBOL res -1120 -336 R90
WINDOW 0 0 56 VBottom 2
WINDOW 3 32 56 VTop 2
SYMATTR InstName R45
SYMATTR Value {layer1R}
SYMBOL res -1136 -640 R90
WINDOW 0 0 56 VBottom 2
WINDOW 3 32 56 VTop 2
SYMATTR InstName R46
SYMATTR Value {layer1R}
SYMBOL res -1104 816 R90
WINDOW 0 0 56 VBottom 2
WINDOW 3 32 56 VTop 2
SYMATTR InstName R47
SYMATTR Value 47k
SYMBOL res -1088 1312 R90
WINDOW 0 0 56 VBottom 2
WINDOW 3 32 56 VTop 2
SYMATTR InstName R48
SYMATTR Value 47k
SYMBOL res 240 -320 R90
WINDOW 0 0 56 VBottom 2
WINDOW 3 32 56 VTop 2
SYMATTR InstName R50
SYMATTR Value {layer1R}
SYMBOL res 208 -752 R90
WINDOW 0 0 56 VBottom 2
WINDOW 3 32 56 VTop 2
SYMATTR InstName R51
SYMATTR Value {layer1R}
SYMBOL res 288 1008 R90
WINDOW 0 0 56 VBottom 2
WINDOW 3 32 56 VTop 2
SYMATTR InstName R52
SYMATTR Value 47k
SYMBOL res 336 1536 R90
WINDOW 0 0 56 VBottom 2
WINDOW 3 32 56 VTop 2
SYMATTR InstName R53
SYMATTR Value 47k
SYMBOL res -2464 4352 R90
WINDOW 0 0 56 VBottom 2
WINDOW 3 32 56 VTop 2
SYMATTR InstName R49
SYMATTR Value {layer2R}
SYMBOL res -2496 4032 R90
WINDOW 0 0 56 VBottom 2
WINDOW 3 32 56 VTop 2
SYMATTR InstName R54
SYMATTR Value {layer2R}
SYMBOL res -2384 5728 R90
WINDOW 0 0 56 VBottom 2
WINDOW 3 32 56 VTop 2
SYMATTR InstName R55
SYMATTR Value 47k
SYMBOL res -2368 6112 R90
WINDOW 0 0 56 VBottom 2
WINDOW 3 32 56 VTop 2
SYMATTR InstName R56
SYMATTR Value 47k
SYMBOL res -1104 4384 R90
WINDOW 0 0 56 VBottom 2
WINDOW 3 32 56 VTop 2
SYMATTR InstName R57
SYMATTR Value {layer2R}
SYMBOL res -1120 3904 R90
WINDOW 0 0 56 VBottom 2
WINDOW 3 32 56 VTop 2
SYMATTR InstName R59
SYMATTR Value {layer2R}
SYMBOL res -1072 5584 R90
WINDOW 0 0 56 VBottom 2
WINDOW 3 32 56 VTop 2
SYMATTR InstName R60
SYMATTR Value 47k
SYMBOL res -1072 5872 R90
WINDOW 0 0 56 VBottom 2
WINDOW 3 32 56 VTop 2
SYMATTR InstName R61
SYMATTR Value 47k
SYMBOL res 64 3728 R90
WINDOW 0 0 56 VBottom 2
WINDOW 3 32 56 VTop 2
SYMATTR InstName R62
SYMATTR Value {layer2R}
SYMBOL res 1456 4064 R90
WINDOW 0 0 56 VBottom 2
WINDOW 3 32 56 VTop 2
SYMATTR InstName R63
SYMATTR Value {layer2R}
SYMBOL res 0 6384 R90
WINDOW 0 0 56 VBottom 2
WINDOW 3 32 56 VTop 2
SYMATTR InstName R64
SYMATTR Value 47k
SYMBOL res 1632 6080 R90
WINDOW 0 0 56 VBottom 2
WINDOW 3 32 56 VTop 2
SYMATTR InstName R65
SYMATTR Value 47k
SYMBOL res -3872 3136 R0
SYMATTR InstName R58
SYMATTR Value 47k
SYMBOL res -2848 3152 R0
SYMATTR InstName R66
SYMATTR Value {inter_R}
SYMBOL res -2352 3152 R0
SYMATTR InstName R67
SYMATTR Value 47k
SYMBOL res -1392 3152 R0
SYMATTR InstName R68
SYMATTR Value {inter_R}
SYMBOL res -912 3152 R0
SYMATTR InstName R69
SYMATTR Value 47k
SYMBOL res -176 3184 R0
SYMATTR InstName R70
SYMATTR Value {inter_R}
SYMBOL res 272 3184 R0
SYMATTR InstName R71
SYMATTR Value 47k
SYMBOL res 1152 3168 R0
SYMATTR InstName R72
SYMATTR Value {inter_R}
SYMBOL res 1760 3152 R0
SYMATTR InstName R73
SYMATTR Value 47k
SYMBOL res 2560 3152 R0
SYMATTR InstName R74
SYMATTR Value {inter_R}
TEXT -6936 2024 Left 6 !.tran 0 200ms 180ms 0.001ms startup
TEXT -6944 2208 Left 6 !.param layer1R=20
TEXT -1928 376 Left 6 ;l1OSC2
TEXT -672 400 Left 6 ;l1OSC3
TEXT 584 352 Left 6 ;l1OSC4
TEXT 1984 376 Left 6 ;l1OSC5
TEXT -3320 384 Left 6 ;l1OSC1
TEXT -6288 3264 Left 6 !.option numdgt 7
TEXT -6232 3400 Left 6 !.option plotwinsize=0
TEXT -2032 5112 Left 6 ;l2OSC2
TEXT -752 5088 Left 6 ;l2OSC3
TEXT 504 5072 Left 6 ;l2OSC4
TEXT 1872 5096 Left 6 ;l2OSC5
TEXT -3432 5152 Left 6 ;l2OSC1
TEXT -6888 2400 Left 6 !.param layer2R=1000
TEXT -6888 2544 Left 6 !.param inter_R=1000

The netlist it stands for:
* coupled_wein_bridge_mirror_interlayer.asc
V1 vee 0 15
V2 0 vcc 15
X§U1 N008 N003 vee vcc l1vout1 LT1001  ; OP07, pins In+ In- V+ V- OUT
R1 l1vout1 N003 100k
R2 N003 0 47k
R3 l1vout1 N013 1020
C1 N013 N008 0.1µ
R4 N008 0 1020
C2 N008 0 0.1µ
X§U2 N009 N004 vee vcc l1vout2 LT1001  ; OP07, pins In+ In- V+ V- OUT
R5 l1vout2 N004 100k
R6 N004 0 47k
R7 l1vout2 N014 1030
C3 N014 N009 0.1µ
R8 N009 0 1030
C4 N009 0 0.1µ
X§U3 N010 N005 vee vcc l1vout3 LT1001  ; OP07, pins In+ In- V+ V- OUT
R11 l1vout3 N005 100k
R12 N005 0 47k
R13 l1vout3 N015 1040
C5 N015 N010 0.1µ
R14 N010 0 1040
C6 N010 0 0.1µ
X§U4 N006 N001 vee vcc l1vout4 LT1001  ; OP07, pins In+ In- V+ V- OUT
R15 l1vout4 N001 100k
R16 N001 0 47k
R17 l1vout4 N011 1050
C7 N011 N006 0.1µ
R18 N006 0 1050
C8 N006 0 0.1µ
X§U5 N007 N002 vee vcc l1vout5 LT1001  ; OP07, pins In+ In- V+ V- OUT
R19 l1vout5 N002 100k
R20 N002 0 47k
R21 l1vout5 N012 1060
C9 N012 N007 0.1µ
R22 N007 0 1060
C10 N007 0 0.1µ
X§U6 N023 N019 vee vcc l2vout1 LT1001  ; OP07, pins In+ In- V+ V- OUT
R9 l2vout1 N019 100k
R10 N019 0 47k
R23 l2vout1 N028 270
C11 N028 N023 0.1µ
R24 N023 0 270
C12 N023 0 0.1µ
X§U7 N024 N020 vee vcc l2vout2 LT1001  ; OP07, pins In+ In- V+ V- OUT
R25 l2vout2 N020 100k
R26 N020 0 47k
R27 l2vout2 N029 270
C13 N029 N024 0.1µ
R28 N024 0 270
C14 N024 0 0.1µ
X§U8 N025 N021 vee vcc l2vout3 LT1001  ; OP07, pins In+ In- V+ V- OUT
R29 l2vout3 N021 100k
R30 N021 0 47k
R31 l2vout3 N030 270
C15 N030 N025 0.1µ
R32 N025 0 270
C16 N025 0 0.1µ
X§U9 N016 N017 vee vcc l2vout4 LT1001  ; OP07, pins In+ In- V+ V- OUT
R33 l2vout4 N017 100k
R34 N017 0 47k
R35 l2vout4 N026 270
C17 N026 N016 0.1µ
R36 N016 0 270
C18 N016 0 0.1µ
X§U10 N022 N018 vee vcc l2vout5 LT1001  ; OP07, pins In+ In- V+ V- OUT
R37 l2vout5 N018 100k
R38 N018 0 47k
R39 l2vout5 N027 270
C19 N027 N022 0.1µ
R40 N022 0 270
C20 N022 0 0.1µ
R41 l1vout3 l1vout1 {layer1R}
R42 l1vout4 l1vout1 {layer1R}
R43 N010 N008 47k
R44 N006 N008 47k
R45 l1vout3 l1vout2 {layer1R}
R46 l1vout5 l1vout2 {layer1R}
R47 N010 N009 47k
R48 N007 N009 47k
R50 l1vout4 l1vout3 {layer1R}
R51 l1vout5 l1vout3 {layer1R}
R52 N006 N010 47k
R53 N007 N010 47k
R49 l2vout2 l2vout1 {layer2R}
R54 l2vout4 l2vout1 {layer2R}
R55 N024 N023 47k
R56 N016 N023 47k
R57 l2vout3 l2vout2 {layer2R}
R59 l2vout4 l2vout2 {layer2R}
R60 N025 N024 47k
R61 N016 N024 47k
R62 l2vout5 l2vout3 {layer2R}
R63 l2vout5 l2vout4 {layer2R}
R64 N022 N025 47k
R65 N022 N016 47k
R58 N008 N023 47k
R66 l1vout1 l2vout1 {inter_R}
R67 N009 N024 47k
R68 l1vout2 l2vout2 {inter_R}
R69 N010 N025 47k
R70 l1vout3 l2vout3 {inter_R}
R71 N006 N016 47k
R72 l1vout4 l2vout4 {inter_R}
R73 N007 N022 47k
R74 l1vout5 l2vout5 {inter_R}
.tran 0 200ms 180ms 0.001ms startup
.param layer1R=20
* l1OSC2
* l1OSC3
* l1OSC4
* l1OSC5
* l1OSC1
.option numdgt 7
.option plotwinsize=0
* l2OSC2
* l2OSC3
* l2OSC4
* l2OSC5
* l2OSC1
.param layer2R=1000
.param inter_R=1000
.lib LTC.lib
.backanno
.end